# Altium schematic sheet Relay_Ctrl.SchDoc
size A2; Organization: Altium Limited; Address1: L3, 12a Rodborough Rd; Address2: Frenchs Forest; Address3: NSW; Address4: Australia 2086
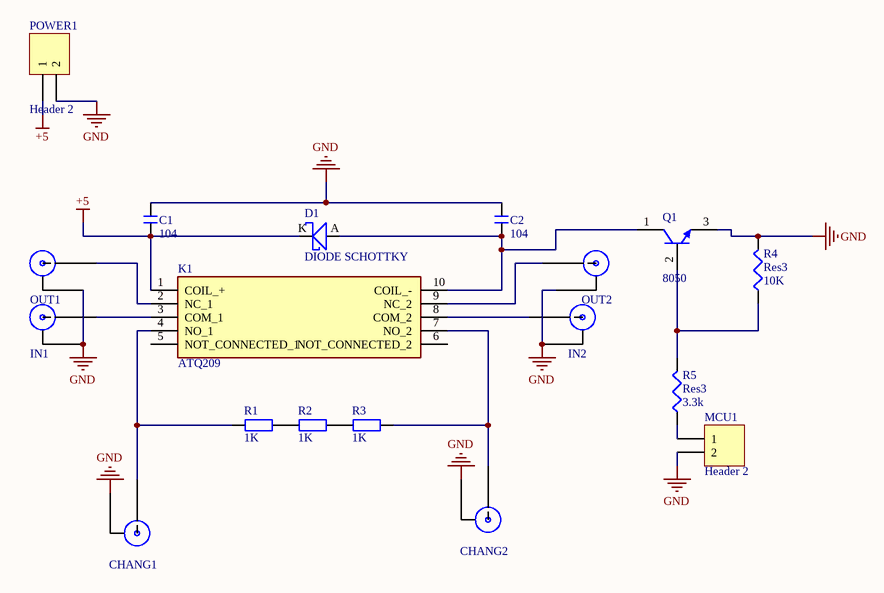
[diagram p0: Relay_Ctrl.SchDoc]

## Parts
C1  104  [0805D]
C2  104  [0805D]
CHANG1  1  [SMA1]  (value not drawn)
CHANG2  1  [SMA1]  (value not drawn)
D1  DIODE SCHOTTKY
IN1  1  [SMA1]  (value not drawn)
IN2  1  [SMA1]  (value not drawn)
K1  ATQ209  [ATQ209]
MCU1  Header 2  [HDR1X2]
OUT1  1  [SMA1]  (value not drawn)
OUT2  1  [SMA1]  (value not drawn)
POWER1  Header 2  [HDR1X2]
Q1  8050  [SOT-23]
R1  1K  [0805D]
R2  1K  [0805D]
R3  1K  [0805D]
R4  Res3  value 10K  [0805D]
R5  Res3  value 3.3k  [0805D]

## Nets
+5: C1.1 D1.K(CATHODE) K1.1(COIL_+) POWER1.1
GND: C1.2 C2.2 CHANG1.2(GND) CHANG2.2(GND) IN1.2(GND) IN2.2(GND) MCU1.2 OUT1.2(GND) OUT2.2(GND) POWER1.2 Q1.3(E) R4.2
NetC2_1: C2.1 D1.A(ANODE) K1.10(COIL_-) Q1.1(C)
NetCHANG1_1: CHANG1.1(sign) K1.4(NO_1) R1.1
NetCHANG2_1: CHANG2.1(sign) K1.7(NO_2) R3.2
NetIN1_1: IN1.1(sign) K1.3(COM_1)
NetIN2_1: IN2.1(sign) K1.8(COM_2)
NetK1_2: K1.2(NC_1) OUT1.1(sign)
NetK1_9: K1.9(NC_2) OUT2.1(sign)
NetMCU1_1: MCU1.1 R5.1
NetQ1_2: Q1.2(B) R4.1 R5.2
NetR1_2: R1.2 R2.1
NetR2_2: R2.2 R3.1

Not connected (* = marked no-connect by the designer): K1 5(NOT_CONNECTED_1) 6(NOT_CONNECTED_2)

## Notes on the sheet
- Title
- Size:
- Date:
- File:
- A2
- Number:
- Time:
- Revision:
- Sheet
- of

## Library data of the parts
C1 C2 = C: 无极性贴片电容; 版权归属: 源创客; BOM名称: 无极性贴片电容; 学习资源: www.ooocke.com
CHANG1 CHANG2 IN1 IN2 OUT1 OUT2 = SMA-side
K1 = ATQ209: Relay or Contactor; Manufacturer_Name: Panasonic; Datasheet Link: https://www3.panasonic.biz/ac/j/dl/catalog/index.jsp?series_cd=1203&part_no=ATQ209; Height: 5.4mm; Manufacturer_Part_Number: ATQ209
MCU1 POWER1 = Header 2: Header, 2-Pin; LatestRevisionDate: 17-Jul-2002; LatestRevisionNote: Re-released for DXP Platform.; Publisher: Altium Limited
Q1 = NPN: NPN Bipolar Transistor; pin to pad: 1>3 2>1 3>2; Published: 8-Jun-2000; LatestRevisionDate: 17-Jul-2002; LatestRevisionNote: Re-released for DXP Platform.; PackageReference: TO-226-AA; Publisher: Altium Limited; PackageDescription: TO, Flat Index; 3 In-Line, Axial Leads; Body Dia. 4.8mm; Leads 0.55 x 0.51 mm (max); Code_JEDEC: TO-226-AA
R1-R3 = R: 贴片电阻; 版权归属: 源创客; BOM名称: 贴片电阻; 学习资源: www.ooocke.com
R4 R5 = Res3: Resistor; Published: 8-Jun-2000; LatestRevisionDate: 29-May-2009; LatestRevisionNote: IPC-7351 Footprint Added.; PackageReference: J1-0603; Publisher: Altium Limited; PackageDescription: Chip Resistor